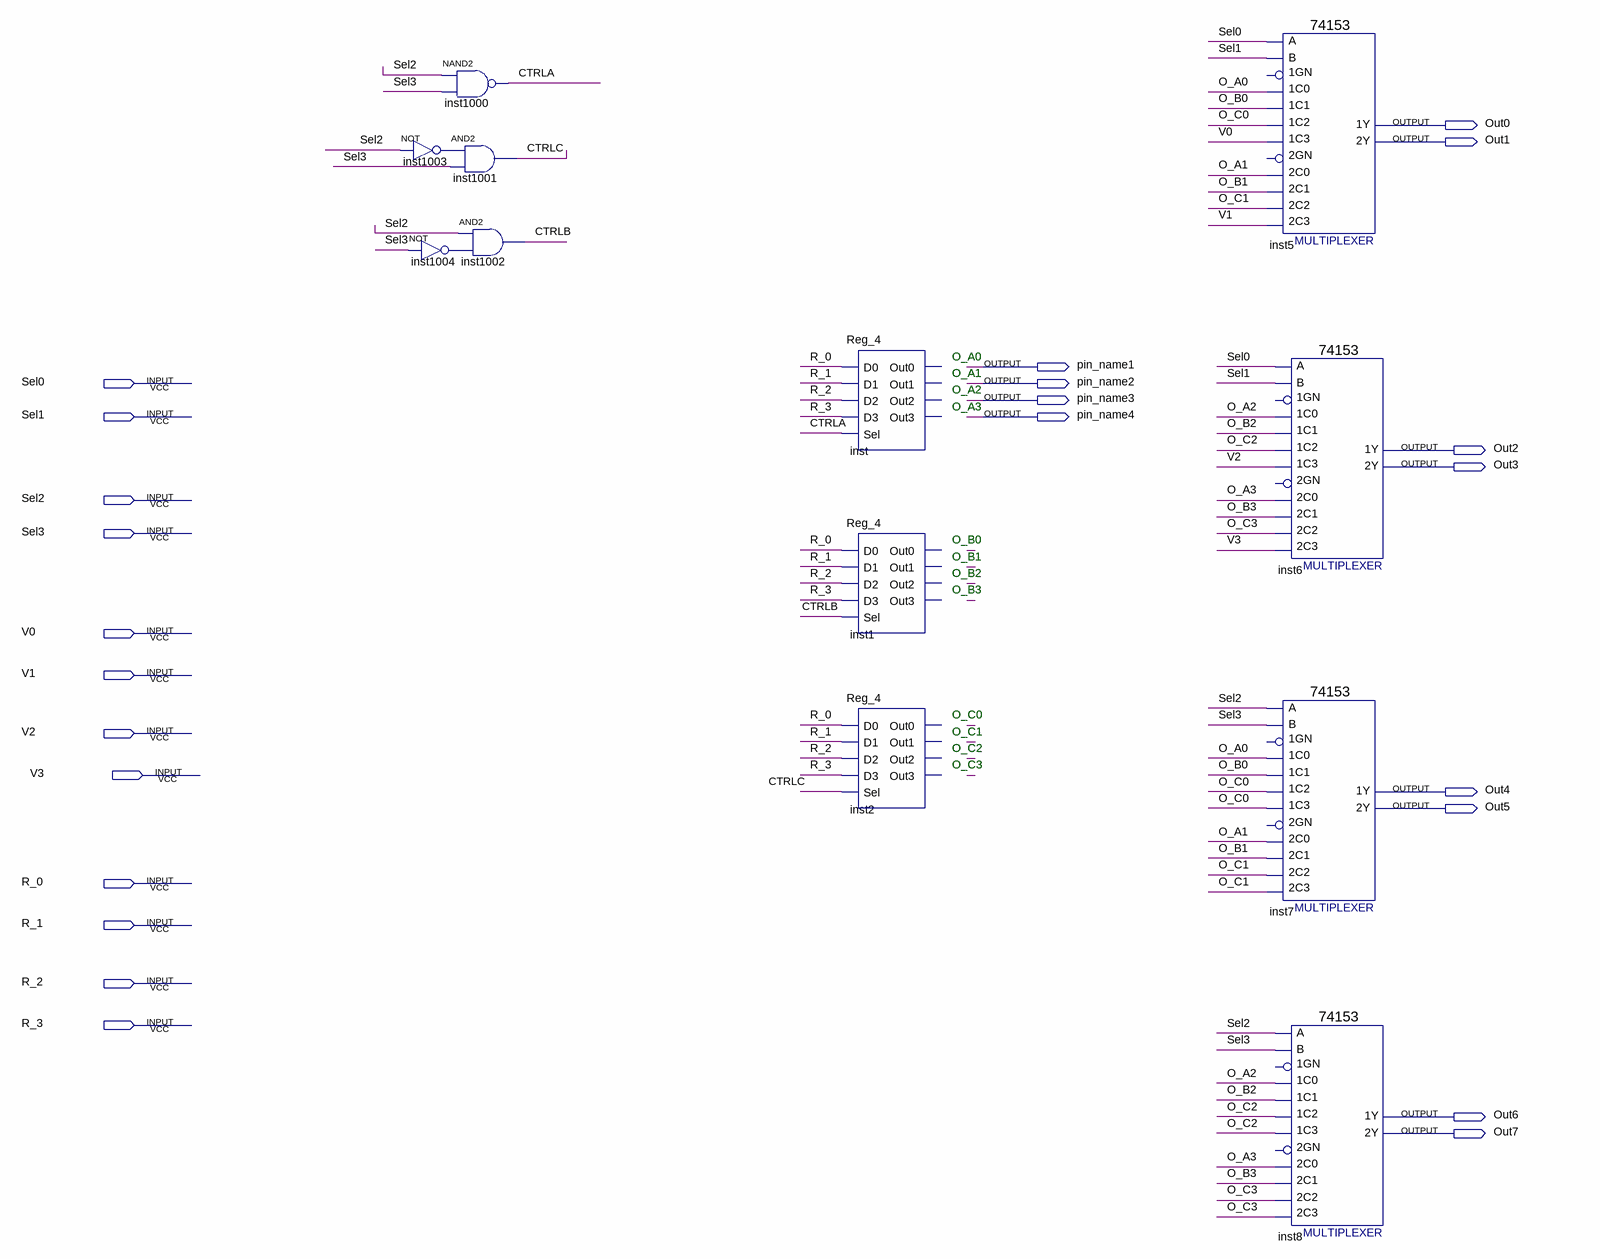
[diagram p0: schematic sheet]
// Quartus schematic Reg_File_Test.bdf as structural Verilog: 12 symbols, 24 pins
module Reg_File_Test (
  input  Sel0,
  input  Sel1,
  input  Sel2,
  input  Sel3,
  input  V0,
  input  V1,
  input  V2,
  input  V3,
  input  R_0,
  input  R_1,
  input  R_2,
  input  R_3,
  output Out0,
  output Out1,
  output pin_name1,
  output pin_name2,
  output pin_name3,
  output pin_name4,
  output Out2,
  output Out3,
  output Out4,
  output Out5,
  output Out6,
  output Out7
);

  wire CTRLA, CTRLB, CTRLC, inst1003_out, inst1004_out, O_B0, O_B1, O_B2, O_B3, O_C0, O_C1, O_C2, O_C3;

  nand inst1000 (CTRLA, Sel2, Sel3);
  not inst1003 (inst1003_out, Sel2);
  not inst1004 (inst1004_out, Sel3);
  and inst1001 (CTRLC, inst1003_out, Sel3);
  and inst1002 (CTRLB, Sel2, inst1004_out);
  Reg_4 inst (.D0(R_0), .D1(R_1), .D2(R_2), .D3(R_3), .Sel(CTRLA));  // open: Out0, Out1, Out2, Out3
  Reg_4 inst1 (.D0(R_0), .D1(R_1), .D2(R_2), .D3(R_3), .Sel(CTRLB));  // open: Out0, Out1, Out2, Out3
  Reg_4 inst2 (.D0(R_0), .D1(R_1), .D2(R_2), .D3(R_3), .Sel(CTRLC));  // open: Out0, Out1, Out2, Out3
  \74153  inst5 (
    .\1C1 (O_B0), .\1C0 (pin_name1), .\2C0 (pin_name2), .\2C2 (O_C1), .\1C2 (O_C0), .\1C3 (V0), .B(Sel1),
    .A(Sel0), .\2C1 (O_B1), .\2C3 (V1), .\1Y (Out0), .\2Y (Out1));  // open: 1GN, 2GN
  \74153  inst6 (
    .\1C1 (O_B2), .\1C0 (pin_name3), .\2C0 (pin_name4), .\2C2 (O_C3), .\1C2 (O_C2), .\1C3 (V2), .B(Sel1),
    .A(Sel0), .\2C1 (O_B3), .\2C3 (V3), .\1Y (Out2), .\2Y (Out3));  // open: 1GN, 2GN
  \74153  inst7 (
    .\1C1 (O_B0), .\1C0 (pin_name1), .\2C0 (pin_name2), .\2C2 (O_C1), .\1C2 (O_C0), .\1C3 (O_C0), .B(Sel3),
    .A(Sel2), .\2C1 (O_B1), .\2C3 (O_C1), .\1Y (Out4), .\2Y (Out5));  // open: 1GN, 2GN
  \74153  inst8 (
    .\1C1 (O_B2), .\1C0 (pin_name3), .\2C0 (pin_name4), .\2C2 (O_C3), .\1C2 (O_C2), .\1C3 (O_C2), .B(Sel3),
    .A(Sel2), .\2C1 (O_B3), .\2C3 (O_C3), .\1Y (Out6), .\2Y (Out7));  // open: 1GN, 2GN

  // Other names for the same wires on the sheet: O_A0 = pin_name1; O_A1 = pin_name2; O_A2 = pin_name3;
  //   O_A3 = pin_name4

  // Notes on the sheet:
  //   O_A0
  //   O_A1
  //   O_A2
  //   O_A3
  //   O_B0
  //   O_B1
  //   O_B2
  //   O_B3
  //   O_C0
  //   O_C1
  //   O_C2
  //   O_C3
endmodule
